# EAGLE design JW24A10L_revD (EAGLE 6.1)
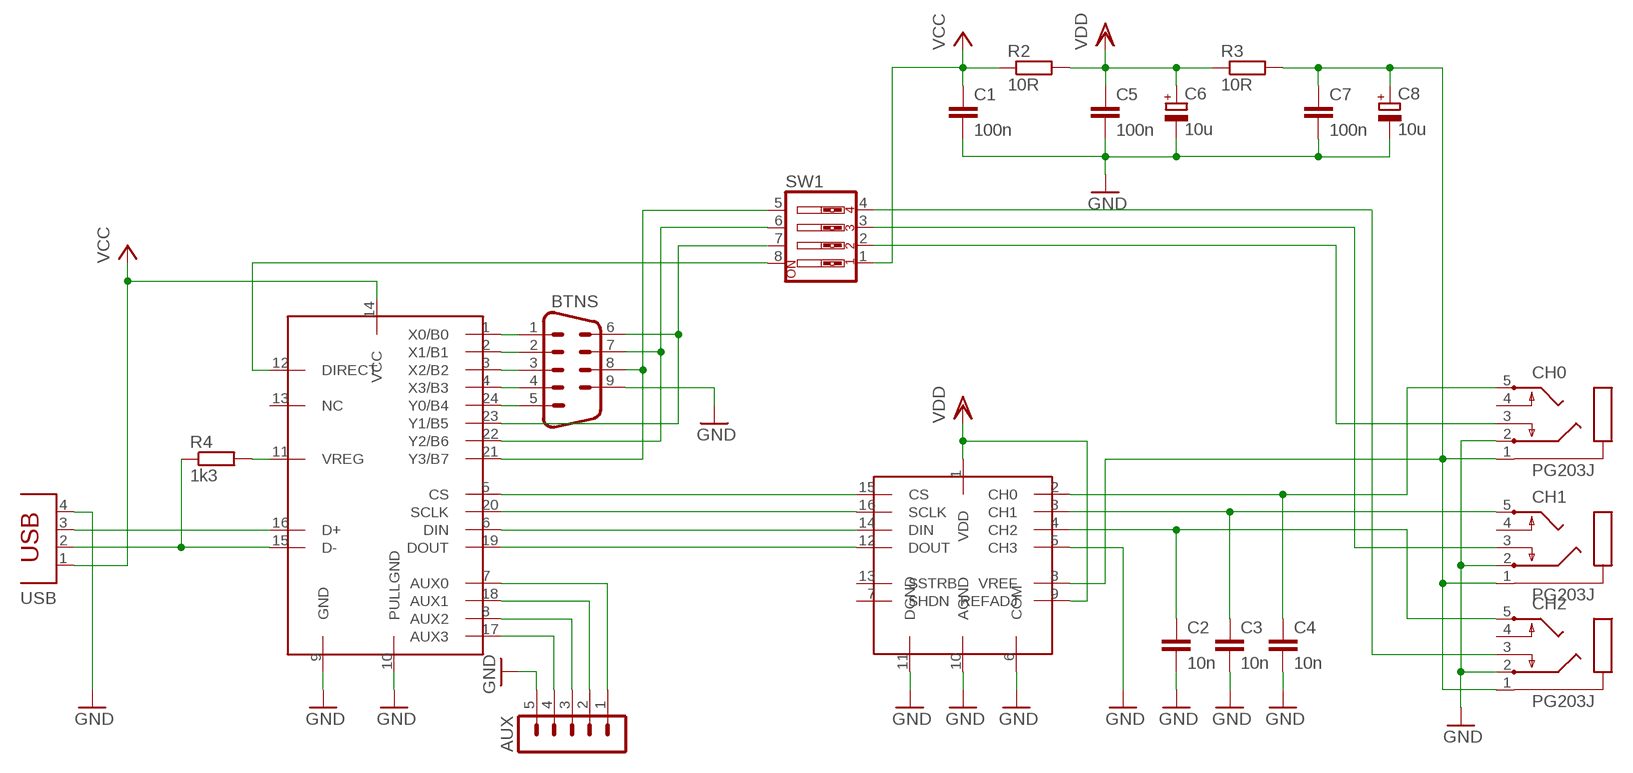
[diagram p0: schematic, sheet 1]

## Parts
AUX  MA05-1  [MA05-1]
BTNS  M09H  [M09H]
C1  100n  C-EU025-025X050  [C025-025X050]
C2  10n  C-EU025-025X050  [C025-025X050]
C3  10n  C-EU025-025X050  [C025-025X050]
C4  10n  C-EU025-025X050  [C025-025X050]
C5  100n  C-EU025-025X050  [C025-025X050]
C6  10u  CPOL-EUE2-5  [E2-5]
C7  100n  C-EU025-025X050  [C025-025X050]
C8  10u  CPOL-EUE2-5  [E2-5]
CH0  PG203J  [PG203J]
CH1  PG203J  [PG203J]
CH2  PG203J  [PG203J]
R2  10R  R-EU_0207/2V  [0207/2V]
R3  10R  R-EU_0207/2V  [0207/2V]
R4  1k3  R-EU_0207/2V  [0207/2V]
SW1  SW_DIP-4  [EDG-04]
U$1  MAX1249  [DIL16]
U$2  JW24A10L  [DIL24-3]
USB  PN61729  [PN61729]

## Nets
AUX0: AUX.1 U$2.7(AUX0)
AUX1: AUX.2 U$2.18(AUX1)
AUX2: AUX.3 U$2.8(AUX2)
AUX3: AUX.4 U$2.17(AUX3)
CH0: C4.1 CH0.5 U$1.2(CH0)
CH1: C3.1 CH1.5 U$1.3(CH1)
CH2: C2.1 CH2.5 U$1.4(CH2)
CH+: C7.1 C8.+ CH0.1 CH1.1 CH2.1 R3.2 U$1.8(VREF)
D+: U$2.16(D+) USB.3
D-: R4.1 U$2.15(D-) USB.2
GND: AUX.5 BTNS.9 C1.2 C2.2 C3.2 C4.2 C5.2 C6.- C7.2 C8.- CH0.2 CH1.2 CH2.2 U$1.5(CH3) U$1.6(COM) U$1.10(AGND) U$1.11(DGND) U$2.9(GND) U$2.10(PULLGND) USB.4
N$1: U$1.15(CS) U$2.5(CS)
N$2: U$1.16(SCLK) U$2.20(SCLK)
N$3: U$1.14(DIN) U$2.6(DIN)
N$4: U$1.12(DOUT) U$2.19(DOUT)
N$7: BTNS.1 U$2.1(X0/B0)
N$9: R4.2 U$2.11(VREG)
N$12: BTNS.2 U$2.2(X1/B1)
N$13: BTNS.3 U$2.3(X2/B2)
N$14: BTNS.4 U$2.4(X3/B3)
N$15: BTNS.5 U$2.24(Y0/B4)
N$16: BTNS.6 SW1.7 U$2.23(Y1/B5)
N$17: BTNS.7 SW1.6 U$2.22(Y2/B6)
N$18: BTNS.8 SW1.5 U$2.21(Y3/B7)
N$19: SW1.8 U$2.12(DIRECT)
STECK0: CH0.3 SW1.2
STECK1: CH1.3 SW1.3
STECK2: CH2.3 SW1.4
VCC: C1.1 R2.1 SW1.1 U$2.14(VCC) USB.1
VDD: C5.1 C6.+ R2.2 R3.1 U$1.1(VDD) U$1.9(REFADJ)
Unconnected: CH0.4 CH1.4 CH2.4 U$1.7(SHDN) U$1.13(SSTRB) U$2.13(NC)

## Library data of the parts
AUX = con-lstb:MA05-1: PIN HEADER; OC_FARNELL: unknown; OC_NEWARK: unknown
BTNS = con-subd:M09: SUB-D; OC_FARNELL: unknown; OC_NEWARK: unknown
C1-C5 C7 = rcl:C-EU: CAPACITOR, European symbol
C6 C8 = rcl:CPOL-EU: POLARIZED CAPACITOR, European symbol
CH0 CH1 CH2 = con-hirschmann:PG203J: MIC/HEADPHONE JACK KS-S stereo microphone/headphone jack PG203JN (Schukat); OC_FARNELL: unknown; OC_NEWARK: unknown
R2-R4 = rcl:R-EU_: RESISTOR, European symbol
SW1 = special:SW_DIP-4: DIP SWITCH
U$1 = eigene:MAX1249
U$2 = eigene:JW24A10L
USB = con-berg:PN61729: BERG USB connector; OC_FARNELL: unknown; OC_NEWARK: unknown

## Board
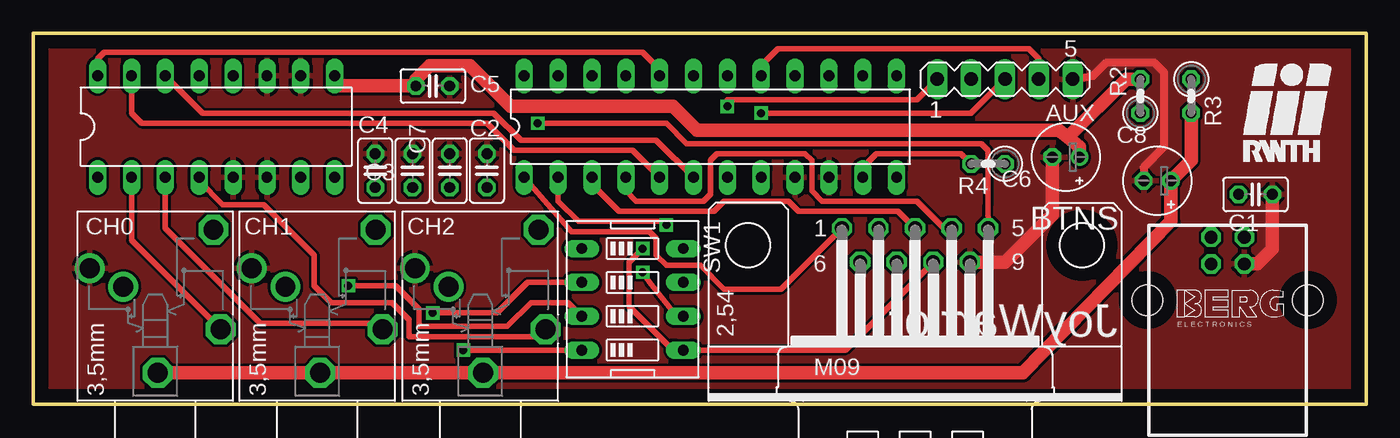
[diagram p1: board, top side]
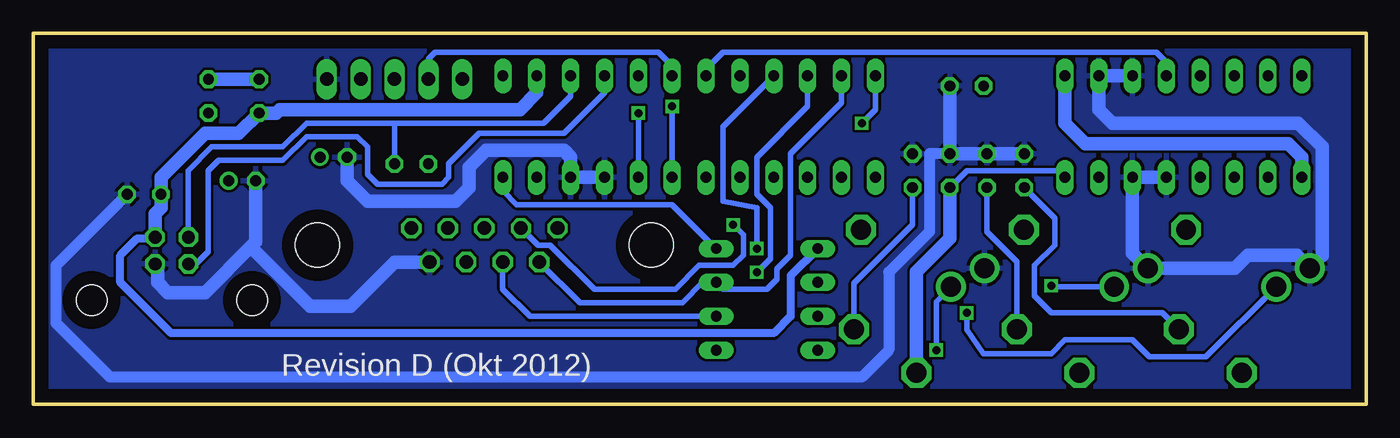
[diagram p2: board, bottom side, seen from below]

Size 100 x 27.82 mm. Coordinates in mm from the lower left corner, seen from the top.
Outline: 100,27.82 0,27.82 0,0 100,0 100,27.82
Copper layers (1*16): Top 0.035mm / dielectric 1.5mm / Bottom 0.035mm
Design rules: minimum track width 10mil, minimum drill 24mil, track to track 8mil, track to pad 8mil, pad to pad 8mil, via to via 8mil, smd to smd 8mil, copper to edge 40mil, drill to drill 8mil, minimum pad ring 10mil, minimum via ring 8mil, stop-mask expansion 4mil, vias tented up to drill 0mil, thermal gap 10mil

### Footprints (pad centres in the part's own frame; a part is rotated, then mirrored left to right if it is on the bottom)
MA05-1 = drill 1.016 long: 1 -5.08,0; 2 -2.54,0; 3 0,0; 4 2.54,0; 5 5.08,0
M09H = drill 1.016 octagon: 1 -5.486,1.27; 2 -2.743,1.27; 3 0,1.27; 4 2.743,1.27; 5 5.486,1.27; 6 -4.115,-1.27; 7 -1.372,-1.27; 8 1.372,-1.27; 9 4.115,-1.27 | hole 3.302: 12.522,0; -12.522,0
C025-025X050 = drill 0.813 octagon: 1 -1.27,0; 2 1.27,0
E2-5 = drill 0.813 pad 1.27: + -1.016,0 | drill 0.813 pad 1.27 octagon: - 1.016,0
PG203J = drill 1.499 octagon: 1 -5.004,-0.203; 4 5.74,-4.369; 5 -1.753,-4.902 | drill 1.499: 2 2.845,4.902; 3 1.448,2.388
0207/2V = drill 0.813 octagon: 1 -1.27,0; 2 1.27,0
EDG-04 = drill 0.813 long: 1 -3.81,-3.81; 2 -1.27,-3.81; 3 1.27,-3.81; 4 3.81,-3.81; 5 3.81,3.81; 6 1.27,3.81; 7 -1.27,3.81; 8 -3.81,3.81
DIL16 = drill 0.813 long: 1 -8.89,-3.81; 2 -6.35,-3.81; 3 -3.81,-3.81; 4 -1.27,-3.81; 5 1.27,-3.81; 6 3.81,-3.81; 7 6.35,-3.81; 8 8.89,-3.81; 9 8.89,3.81; 10 6.35,3.81; 11 3.81,3.81; 12 1.27,3.81; 13 -1.27,3.81; 14 -3.81,3.81; 15 -6.35,3.81; 16 -8.89,3.81
DIL24-3 = drill 0.813 long: 1 -13.97,-3.81; 2 -11.43,-3.81; 3 -8.89,-3.81; 4 -6.35,-3.81; 5 -3.81,-3.81; 6 -1.27,-3.81; 7 1.27,-3.81; 8 3.81,-3.81; 9 6.35,-3.81; 10 8.89,-3.81; 11 11.43,-3.81; 12 13.97,-3.81; 13 13.97,3.81; 14 11.43,3.81; 15 8.89,3.81; 16 6.35,3.81; 17 3.81,3.81; 18 1.27,3.81; 19 -1.27,3.81; 20 -3.81,3.81; 21 -6.35,3.81; 22 -8.89,3.81; 23 -11.43,3.81; 24 -13.97,3.81
PN61729 = drill 0.95 octagon: 1 1.25,4.71; 2 -1.25,4.71; 3 -1.25,2.71; 4 1.25,2.71 | hole 2.3: -6.02,0; 6.02,0

### Placement (x,y rotation side)
AUX  72.9,24.38 0 top
BTNS  66.15,11.94 0 top
C1  91.69,15.75 0 top
C2  34.04,17.53 90 top
C3  28.45,17.53 90 top
C4  25.65,17.53 90 top
C5  29.97,23.88 0 top
C6  77.47,18.54 180 top
C7  31.24,17.53 90 top
C8  84.33,16.76 180 top
CH0  9.14,7.37 90 top
CH1  21.3,7.37 90 top
CH2  33.53,7.37 90 top
R2  83.06,23.11 90 top
R3  86.87,23.11 270 top
R4  71.63,18.03 180 top
SW1  44.96,7.87 270 top
U$1  13.72,20.83 0 top
U$2  50.8,20.83 0 top
USB  89.61,7.82 0 top

### Tracks (layer width: path | path; a pad name or v marks a point on that pad's centre or on a via)
AUX0  (via drill 0.6)
  Top 0.406: AUX.1 66.29,22.86 52.07,22.86 v52.07,22.35
  Bottom 0.406: v52.07,22.35 U$2.7
AUX1
  Bottom 0.406: AUX.2 70.36,25.91 69.85,26.42 53.09,26.42 52.07,25.4 U$2.18
AUX2  (via drill 0.6)
  Top 0.406: AUX.3 70.36,21.84 v54.61,21.84
  Bottom 0.406: v54.61,21.84 U$2.8
AUX3
  Top 0.406: AUX.4 75.44,25.91 74.68,26.67 55.88,26.67 54.61,25.4 U$2.17
CH0
  Top 0.406: U$1.2 7.37,12.29 CH0.5
  Bottom 0.406: CH0.5 15.29,6.86 23.62,6.86 24.89,8.13 24.89,10.41 23.37,11.94 23.37,13.97 C4.1
CH1
  Top 0.406: U$1.3 9.91,13.21 17.02,6.1 25.72,6.1 CH1.5
  Bottom 0.406: CH1.5 26.2,10.71 28.45,12.95 C3.1
CH2
  Top 0.406: U$1.4 12.45,16.76 14.22,14.99 17.27,14.99 21.08,11.18 21.08,8.89 22.35,7.62 26.92,7.62 28.19,6.35 28.19,5.08 37.95,5.08 CH2.5
  Bottom 0.406: CH2.5 38.43,9.07 34.04,13.46 C2.1
CH+
  Top 1.016: CH0.1 CH1.1 CH2.1 74.24,2.36 85.34,13.72 C8.+ 86.87,18.29 R3.2
  Bottom 0.406: C7.1 30.23,17.27 29.97,17.53 23.11,17.53 U$1.8
  Bottom 1.016: C7.1 31.24,12.45 33.73,9.96 CH2.1
D+
  Bottom 0.406: U$2.16 57.15,23.37 60.2,20.32 66.55,20.32 68.83,18.03 68.83,17.02 69.34,16.51 74.17,16.51 74.93,17.27 74.93,19.3 75.69,20.07 79.5,20.07 81.28,18.29 86.11,18.29 86.87,17.53 86.87,11.43 87.77,10.53 USB.3
D-
  Bottom 0.406: U$2.15 59.69,23.11 61.72,21.08 72.9,21.08 | R4.1 72.9,21.08 | 72.9,21.08 79.5,21.08 81.28,19.3 86.61,19.3 88.39,17.53 88.39,12.56 USB.2
GND
  Top 0.61: AUX.5 79.5,24.64 80.52,25.65 84.07,25.65 84.84,24.89 84.84,19.3 83.31,17.78 C8.-
  Top 1.016: C1.2 92.96,11.68 91.81,10.53 USB.4 | BTNS.9 72.9,10.67 75.69,13.46 76.45,14.22 C6.-
  Bottom 0.813: C7.2 32.77,18.8 32.77,12.95 35.81,9.91 35.81,4.06 37.85,2.03 94.23,2.03 98.3,6.1 98.3,10.41 C1.2
  Bottom 1.016: U$1.5 U$1.6 17.53,14.73 17.53,11.34 CH1.2 9.86,10.21 8.89,11.18 5.21,11.18 CH0.2 | U$1.11 U$1.10 20.07,22.1 19.05,21.08 5.08,21.08 3.3,19.3 3.3,11.15 | C4.2 C3.2 C7.2 C5.2 | U$2.9 U$2.10 59.69,18.54 60.2,19.05 66.04,19.05 67.31,17.78 67.31,16.26 68.33,15.24 74.93,15.24 76.45,16.76 C6.- | C8.- 83.31,12.19 83.69,11.81 | 83.69,11.81 87.12,8.38 89.92,8.38 90.68,9.14 90.68,10.41 90.93,10.41 90.93,10.46 USB.4 | BTNS.9 72.9,10.67 76.2,7.37 79.25,7.37 83.69,11.81
  pour Bottom: 0.76,27.43 100.08,27.43 99.57,0.51 0.51,0.51
  pour Top: 0.76,27.43 100.08,27.43 99.57,0.51 0.51,0.51
N$1
  Top 0.406: U$1.15 7.37,21.84 8.13,21.08 34.04,21.08 36.07,19.05 44.96,19.05 U$2.5
N$2
  Top 0.406: U$1.16 4.83,25.91 5.33,26.42 45.72,26.42 46.99,25.15 U$2.20
N$3
  Top 0.406: U$1.14 12.7,21.84 34.54,21.84 36.58,19.81 46.74,19.81 U$2.6
N$4
  Bottom 0.406: U$1.12 14.99,25.65 15.75,26.42 48.26,26.42 49.53,25.15 U$2.19
N$7
  Top 0.406: U$2.1 40.39,12.95 46.23,12.95 46.74,12.45 46.74,11.18 47.5,10.41 50.04,10.41 51.82,8.64 56.1,8.64 BTNS.1
N$9
  Top 0.406: U$2.11 62.23,17.78 63.25,18.8 69.6,18.8 R4.2
N$12  (via drill 0.6)
  Top 0.406: U$2.2 39.37,15.24 40.89,13.72 47.24,13.72 v47.5,13.46
  Bottom 0.406: BTNS.2 62.14,11.94 61.21,11.94 57.91,8.64 51.82,8.64 50.04,10.41 47.5,10.41 46.74,11.18 46.74,12.7 v47.5,13.46
N$13
  Top 0.406: U$2.3 41.91,16.51 43.94,14.48 51.05,14.48 51.82,15.24 56.64,15.24 57.4,14.48 64.88,14.48 BTNS.3
N$14
  Top 0.406: U$2.4 44.45,16 45.21,15.24 50.29,15.24 50.8,15.75 50.8,18.29 51.31,18.8 57.91,18.8 58.42,18.29 58.42,16 59.18,15.24 66.29,15.24 68.33,13.21 BTNS.4
N$15  (via drill 0.6)
  Top 0.406: BTNS.5 71.63,14.97 71.63,19.05 71.12,19.56 49.02,19.56 47.5,21.08 v37.85,21.08
  Bottom 0.406: U$2.24 36.83,22.1 v37.85,21.08
N$16
  Bottom 0.406: U$2.23 39.37,22.61 43.18,18.8 43.18,11.18 44.2,10.16 44.2,9.4 44.96,8.64 48.26,8.64 SW1.7 49.78,9.14 51.31,7.62 58.99,7.62 BTNS.6
N$17  (via drill 0.6)
  Top 0.406: SW1.6 48.26,6.6 46.23,9.14 v45.72,9.91
  Bottom 0.406: U$2.22 41.91,22.35 45.72,18.54 45.72,15.75 44.7,14.73 44.7,10.92 v45.72,9.91 | SW1.6 62.74,6.6 64.78,8.65 BTNS.7
N$18  (via drill 0.6)
  Top 0.406: BTNS.8 60.92,4.06 SW1.5 48.01,4.06 44.7,7.37 44.7,10.67 v45.72,11.68
  Bottom 0.406: U$2.21 48.26,20.83 48.26,15.24 45.72,14.73 v45.72,11.68
N$19
  Bottom 0.406: U$2.12 64.77,16 63.75,14.99 52.07,14.99 SW1.8
STECK0  (via drill 0.6)
  Top 0.406: v29.97,6.86 34.8,6.86 37.08,9.14 SW1.2
  Bottom 0.406: CH0.3 12.01,3.56 16.26,3.56 17.53,4.83 22.61,4.83 23.62,3.81 28.7,3.81 29.97,5.59 v29.97,6.86
STECK1  (via drill 0.6)
  Top 0.406: SW1.3 40.13,7.62 37.34,7.62 35.56,5.84 28.96,5.84 28.96,7.11 27.18,8.89 v23.62,8.89
  Bottom 0.406: v23.62,8.89 23.04,8.81 CH1.3
STECK2  (via drill 0.6)
  Top 0.406: SW1.4 v32.26,4.06
  Bottom 0.406: v32.26,4.06 32.26,7.7 CH2.3
VCC
  Bottom 0.61: SW1.1 43.18,9.65 43.18,6.6 44.45,5.33 89.66,5.33 93.47,9.14 93.47,11.18 92.2,12.45 90.95,12.45 USB.1
  Bottom 1.016: U$2.14 62.23,23.37 63.5,22.1 81.53,22.1 81.79,21.84 R2.1 84.58,20.32 87.12,20.32 90.42,17.02 C1.1 90.42,14.73 90.86,14.29 USB.1
VDD
  Top 1.016: U$1.9 22.86,23.88 C5.1 28.7,24.38 29.72,25.4 32.77,25.4 35.81,22.35 48.01,22.35 49.78,20.57 76.96,20.57 77.64,20.01 | 77.64,20.01 78.49,19.3 C6.+ | R2.2 82.01,24.38 77.64,20.01
  Bottom 1.016: U$1.1 4.83,18.54 5.84,19.56 21.08,19.56 22.61,21.08 U$1.9 | R3.1 R2.2

### Text on the board
tPlace: JoyWarrior
bPlace: Revision D (Okt 2012)